# Altium schematic sheet RPi_TSOP.SchDoc: RasspberryPi - TSOP Adapter Board
size A4; Engineer: DMH; Revision: A0; SheetNumber: 1; SheetTotal: 1
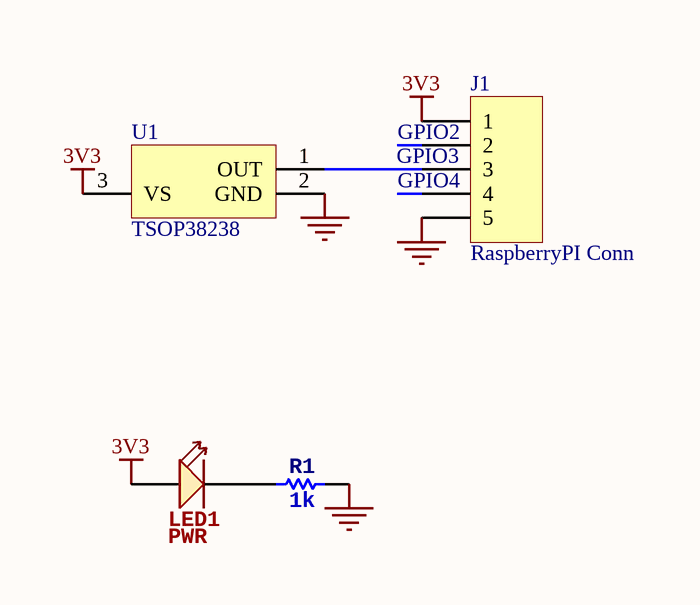
[diagram p0: RPi_TSOP.SchDoc]

## Parts
J1  RaspberryPI Conn  [HDR1X5]
LED1  PWR  [LED-0805]
R1  value 1k  [RESC1206(3216)_M]  (hidden comment: Resistor)
U1  TSOP38238  [VISH-TSOP38238]

## Nets
3V3: J1.1 LED1.+ U1.3(VS)
GND: J1.5 R1.2 U1.2(GND)
GPIO2: J1.2
GPIO3: J1.3 U1.1(OUT)
GPIO4: J1.4
NetLED1_-: LED1.- R1.1

## Notes on the sheet
- Title
- Size:
- Date:
- A4
- Number:
- Time:
- Revision:
- Sheet
- of
- File:

## Library data of the parts
J1 = Header 5: Header, 5-Pin; LatestRevisionDate: 17-Jul-2002; LatestRevisionNote: Re-released for DXP Platform.; Publisher: Altium Limited
LED1 = SMD-LED-CLEAR-RED(0805): 5V Power Indicator; MPN: 17-215SURC/S530-A2/TR8; Value: LED-0805; PackageDescription: 0805; PackageReference: 0805
R1 = CMP-2003-01077-1: RESISTOR, SMD, 1206; Tolerance: 5%; PackageDescription: 1206; PackageReference: 1206
U1 = CMP-1666-00022-1: IR Receiver Modules for Remote Control System, 2.5 to 5.5 V, -25 to 85 degC, 3-Pin THD, RoHS, Bulk; Tolerance: 30ppm; ESR: 40 Ohm; Capacitance: 1.8E-11 f; Frequency: 24 MHz; Load Capacitance: 18 pF; DatasheetVersion: Rev. 1.5, 07/2016; REACH SVHC: No SVHC; Frequency Tolerance: 30ppm; ComponentLink2URL: http://www.vishay.com/docs/82491/tsop382.pdf; Mount: Surface Mount; Length: 0.197 inch; Min Operating Temperature: -20degC; Packaging: Tape and Reel; ComponentLink1URL: http://www.vishay.com/; Width: 0.126 inch; Height: 0.041 inch; PackageDescription: 3-Pin Through Hole Device, Body 5.00 x 4.80 mm, Pitch 2.54 mm; Max Operating Temperature: 70degC; Pins: 4; RoHSCompliant: True; Package Quantity: 1000; PackageReference: VISH-TSOP38238; ComponentLink2Description: Datasheet; ComponentLink1Description: Manufacturer URL; Resistance: 40 Ohm